# EAGLE design ArduSensor-Switch (EAGLE 6.0)
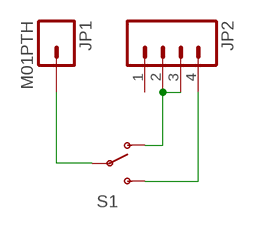
[diagram p0: schematic, sheet 1]

## Parts
JP1  M01PTH  [1X01]
JP2  M04PTH  [1X04]
S1  SWITCH-SPDTPTH  [SWITCH-SPDT]

## Nets
N$1: JP2.2 JP2.3 S1.1(O)
N$2: JP1.1 S1.2(P)
N$3: JP2.4 S1.3(S)
Unconnected: JP2.1

## Library data of the parts
JP1 = SFE Connectors:M01: Header 1 Standard 1-pin 0.1" header. Use with straight break away headers (SKU : PRT-00116), right angle break away headers (PRT-00553), swiss pins (PRT-00743), machine pins (PRT-00117), and female headers (PRT-00115).
JP2 = SFE Connectors:M04: Header 4 Standard 4-pin 0.1" header. Use with straight break away headers (SKU : PRT-00116), right angle break away headers (PRT-00553), swiss pins (PRT-00743), machine pins (PRT-00117), and female headers (PRT-00115). Molex polarized connector foot print use with SKU : PRT-08231 with associated crimp pins and housings. 1MM SMD Version SKU: PRT-10208
S1 = SFE Electromechanical:SWITCH-SPDT: SPST Switch Simple slide switch. Spark Fun Electronics SKU : COM-00102

## Board
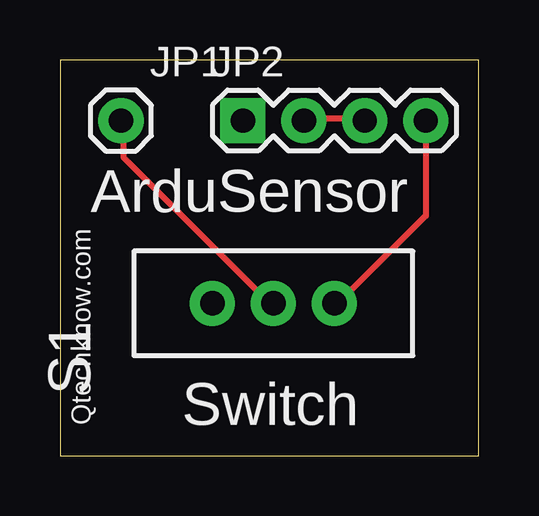
[diagram p1: board, top side]
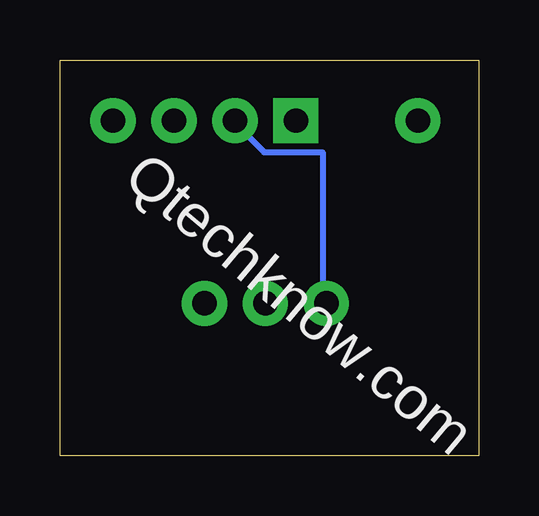
[diagram p2: board, bottom side, seen from below]

Size 17.45 x 16.5 mm. Coordinates in mm from the lower left corner, seen from the top.
Outline: 0,0 17.45,0 17.45,16.5 0,16.5 0,0
Copper layers (1*16): Top 0.035mm / dielectric 1.5mm / Bottom 0.035mm
Design rules: minimum track width 10mil, minimum drill 24mil, track to track 8mil, track to pad 8mil, pad to pad 8mil, via to via 8mil, smd to smd 8mil, copper to edge 40mil, drill to drill 8mil, minimum pad ring 10mil, minimum via ring 8mil, stop-mask expansion 4mil, vias tented up to drill 0mil, thermal gap 10mil

### Footprints (pad centres in the part's own frame; a part is rotated, then mirrored left to right if it is on the bottom)
1X01 = drill 1.016 pad 1.88: 1 0,0
1X04 = drill 1.016 pad 1.88 square: 1 0,0 | drill 1.016 pad 1.88: 2 2.54,0; 3 5.08,0; 4 7.62,0
SWITCH-SPDT = drill 1.016 pad 1.88: 1 0,2.54; 2 0,0; 3 0,-2.54

### Placement (x,y rotation side)
JP1  2.54,13.97 0 top
JP2  7.62,13.97 0 top
S1  8.89,6.35 90 top

### Tracks (layer width: path | path; a pad name or v marks a point on that pad's centre or on a via)
N$1
  Top 0.254: JP2.3 12.6,14.07 10.16,14.07 JP2.2
  Bottom 0.254: S1.1 6.5,6.35 6.5,12.65 8.94,12.65 10.16,13.87 JP2.2
N$2
  Top 0.254: S1.2 8.74,6.35 2.64,12.45 2.64,13.87 JP1.1
N$3
  Top 0.254: JP2.4 15.24,10.01 11.58,6.35 S1.3

### Text on the board
tPlace: ArduSensor | Qtechknow.com | Switch
bPlace: Qtechknow.com